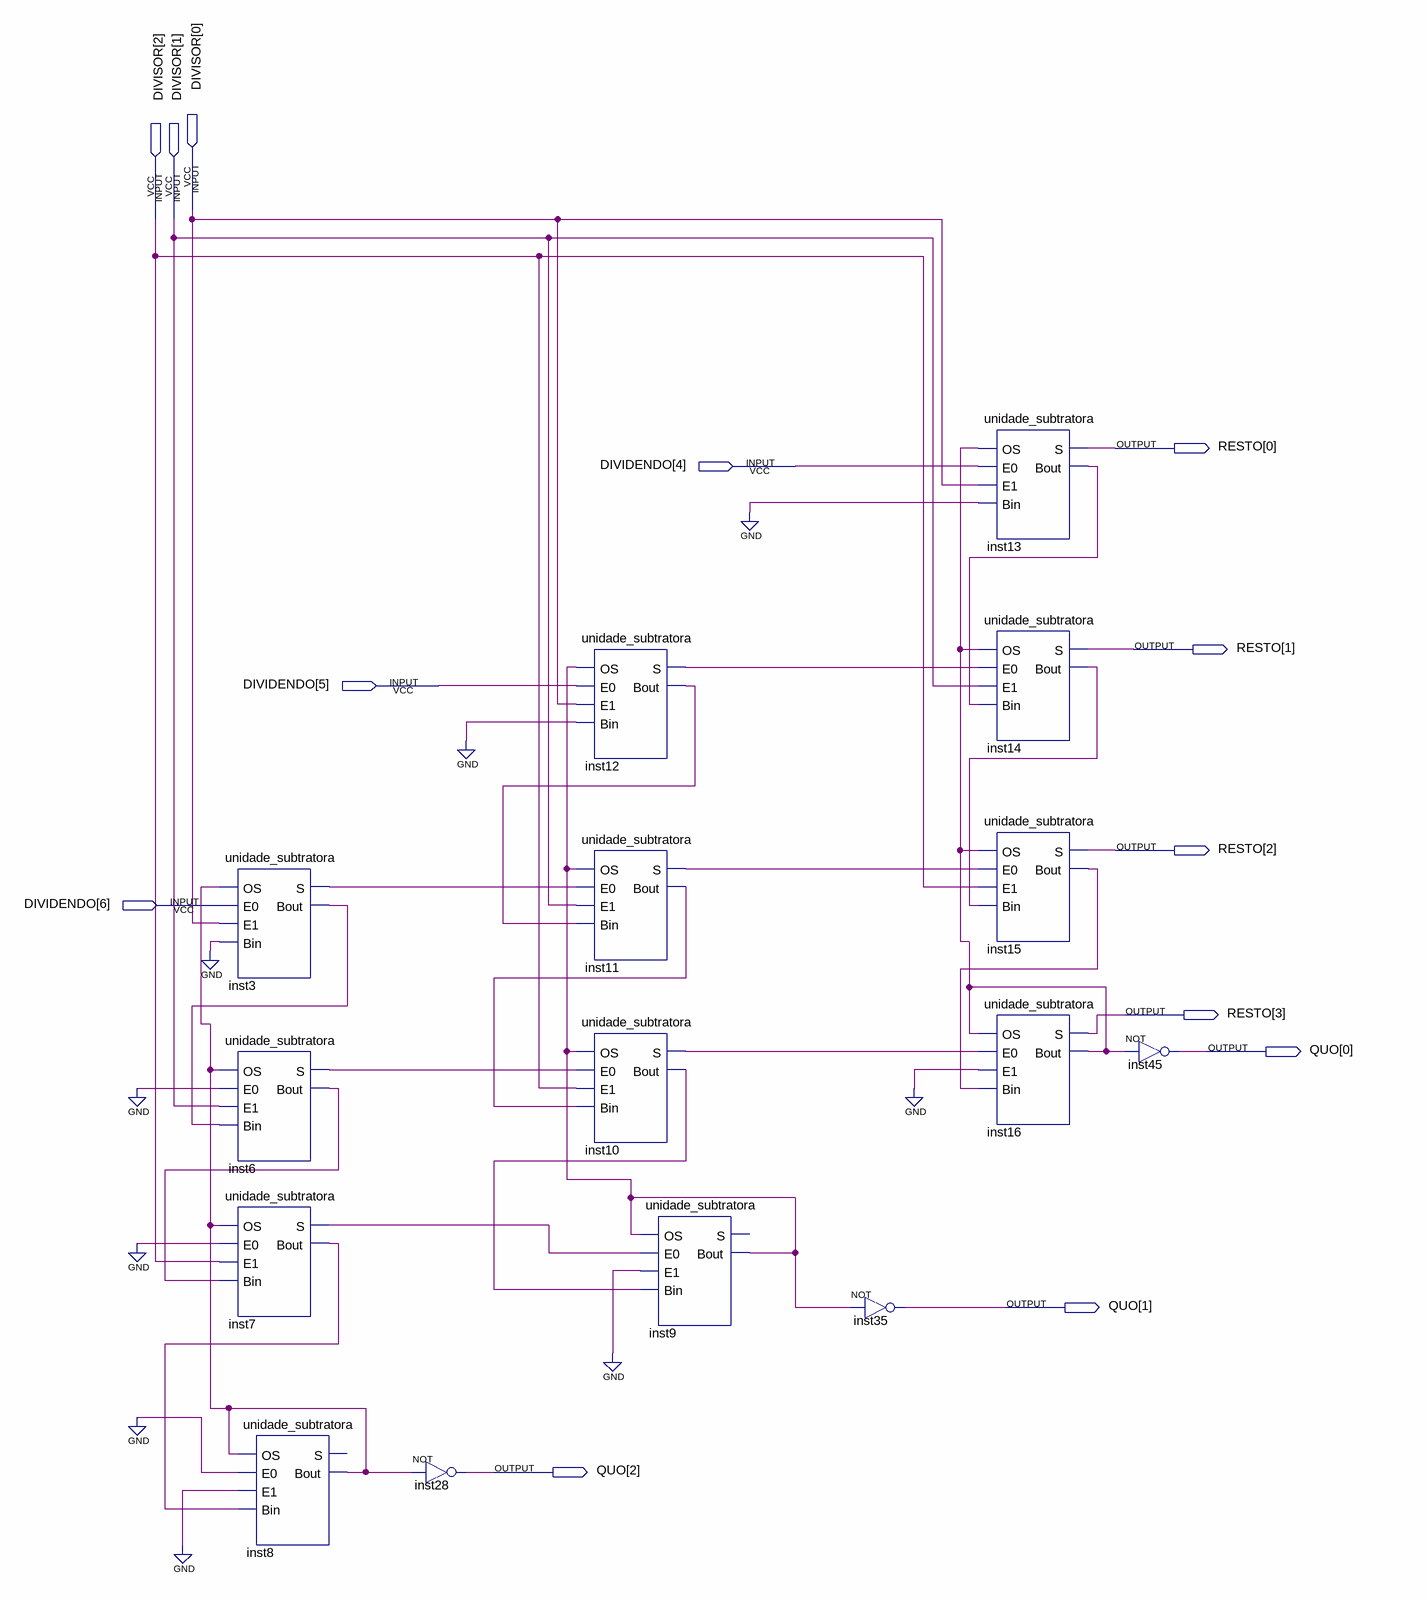
[diagram p0: schematic sheet]
// Quartus schematic divisor_3bits.bdf as structural Verilog: 15 symbols, 13 pins
module divisor_3bits (
  input  [2:0] DIVISOR,
  input  [6:4] DIVIDENDO,
  output [3:0] RESTO,
  output [2:0] QUO
);

  wire inst3_bout, inst3_s, inst6_bout, inst6_s, inst7_bout, inst7_s, inst8_bout, inst9_bout, inst10_bout,
       inst10_s, inst11_bout, inst11_s, inst12_bout, inst12_s, inst13_bout, inst14_bout, inst15_bout,
       inst16_bout;

  unidade_subtratora inst3 (
    .OS(inst8_bout), .E0(DIVIDENDO[6]), .E1(DIVISOR[0]), .Bin(1'b0), .S(inst3_s), .Bout(inst3_bout));
  unidade_subtratora inst6 (
    .OS(inst8_bout), .E0(1'b0), .E1(DIVISOR[1]), .Bin(inst3_bout), .S(inst6_s), .Bout(inst6_bout));
  unidade_subtratora inst7 (
    .OS(inst8_bout), .E0(1'b0), .E1(DIVISOR[2]), .Bin(inst6_bout), .S(inst7_s), .Bout(inst7_bout));
  unidade_subtratora inst8 (.OS(inst8_bout), .E0(1'b0), .E1(1'b0), .Bin(inst7_bout), .Bout(inst8_bout));  // open: S
  not inst28 (QUO[2], inst8_bout);
  unidade_subtratora inst12 (
    .OS(inst9_bout), .E0(DIVIDENDO[5]), .E1(DIVISOR[0]), .Bin(1'b0), .S(inst12_s), .Bout(inst12_bout));
  unidade_subtratora inst11 (
    .OS(inst9_bout), .E0(inst3_s), .E1(DIVISOR[1]), .Bin(inst12_bout), .S(inst11_s), .Bout(inst11_bout));
  unidade_subtratora inst10 (
    .OS(inst9_bout), .E0(inst6_s), .E1(DIVISOR[2]), .Bin(inst11_bout), .S(inst10_s), .Bout(inst10_bout));
  unidade_subtratora inst9 (.OS(inst9_bout), .E0(inst7_s), .E1(1'b0), .Bin(inst10_bout), .Bout(inst9_bout));  // open: S
  not inst35 (QUO[1], inst9_bout);
  unidade_subtratora inst13 (
    .OS(inst16_bout), .E0(DIVIDENDO[4]), .E1(DIVISOR[0]), .Bin(1'b0), .S(RESTO[0]), .Bout(inst13_bout));
  unidade_subtratora inst14 (
    .OS(inst16_bout), .E0(inst12_s), .E1(DIVISOR[1]), .Bin(inst13_bout), .S(RESTO[1]), .Bout(inst14_bout));
  unidade_subtratora inst15 (
    .OS(inst16_bout), .E0(inst11_s), .E1(DIVISOR[2]), .Bin(inst14_bout), .S(RESTO[2]), .Bout(inst15_bout));
  unidade_subtratora inst16 (
    .OS(inst16_bout), .E0(inst10_s), .E1(1'b0), .Bin(inst15_bout), .S(RESTO[3]), .Bout(inst16_bout));
  not inst45 (QUO[0], inst16_bout);
endmodule
